# EAGLE board M8650D+cpld (EAGLE 6.6.0), part 1 of 2
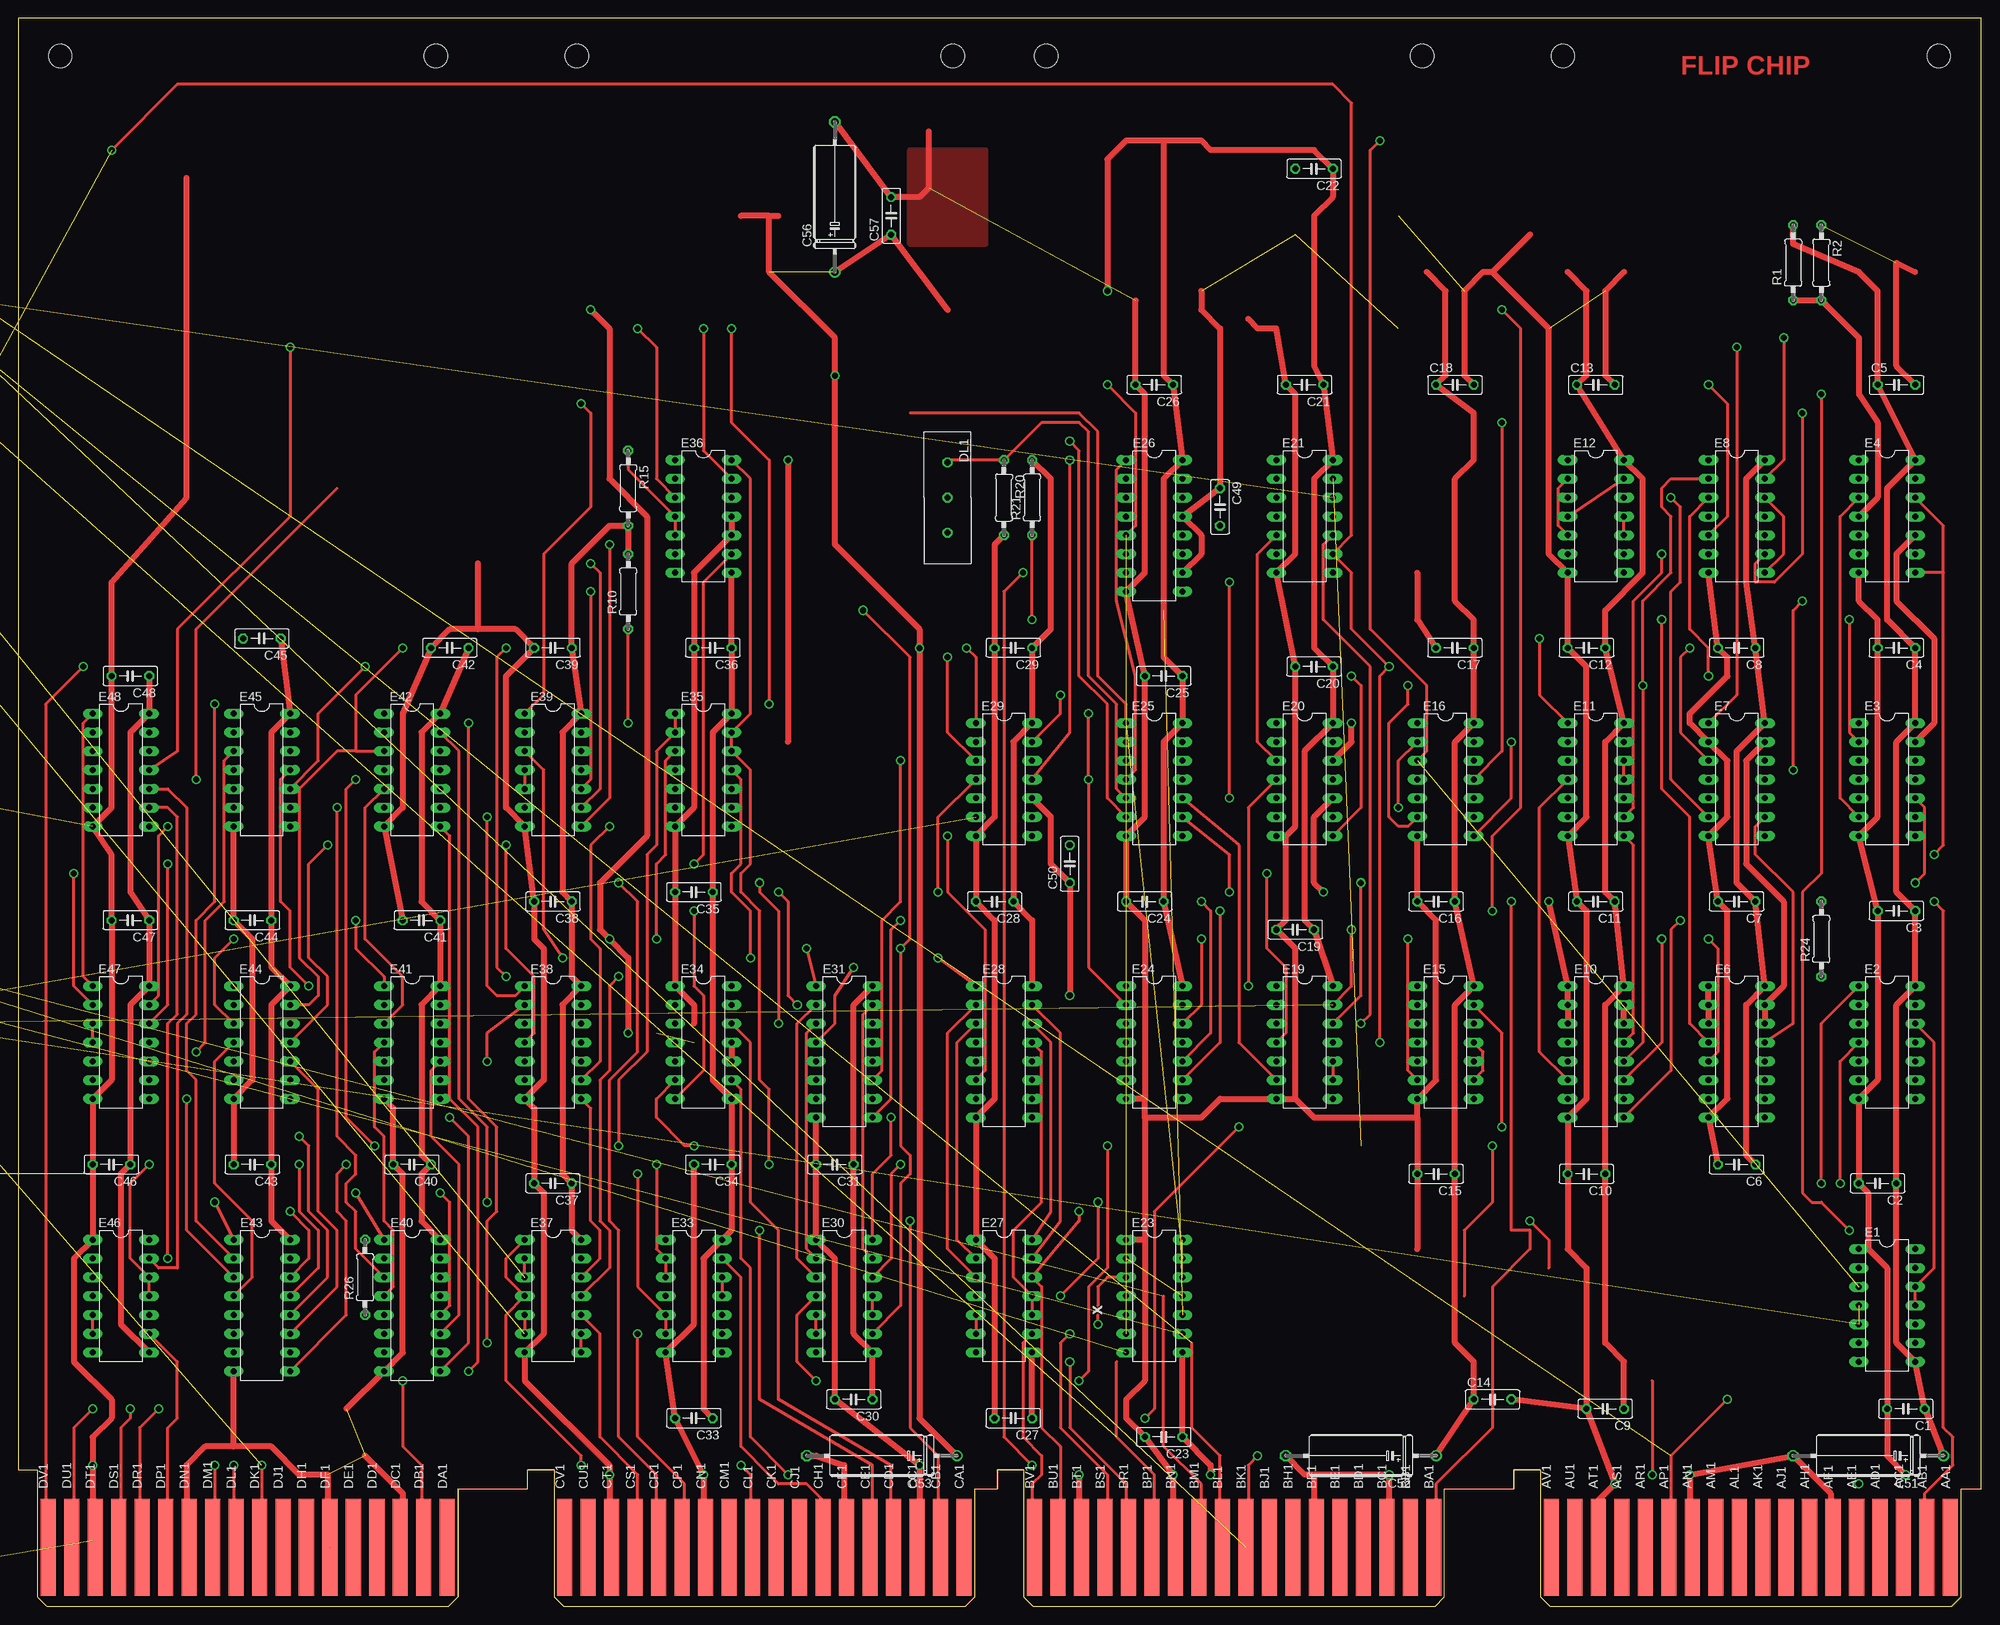
[diagram p3: board, top side]
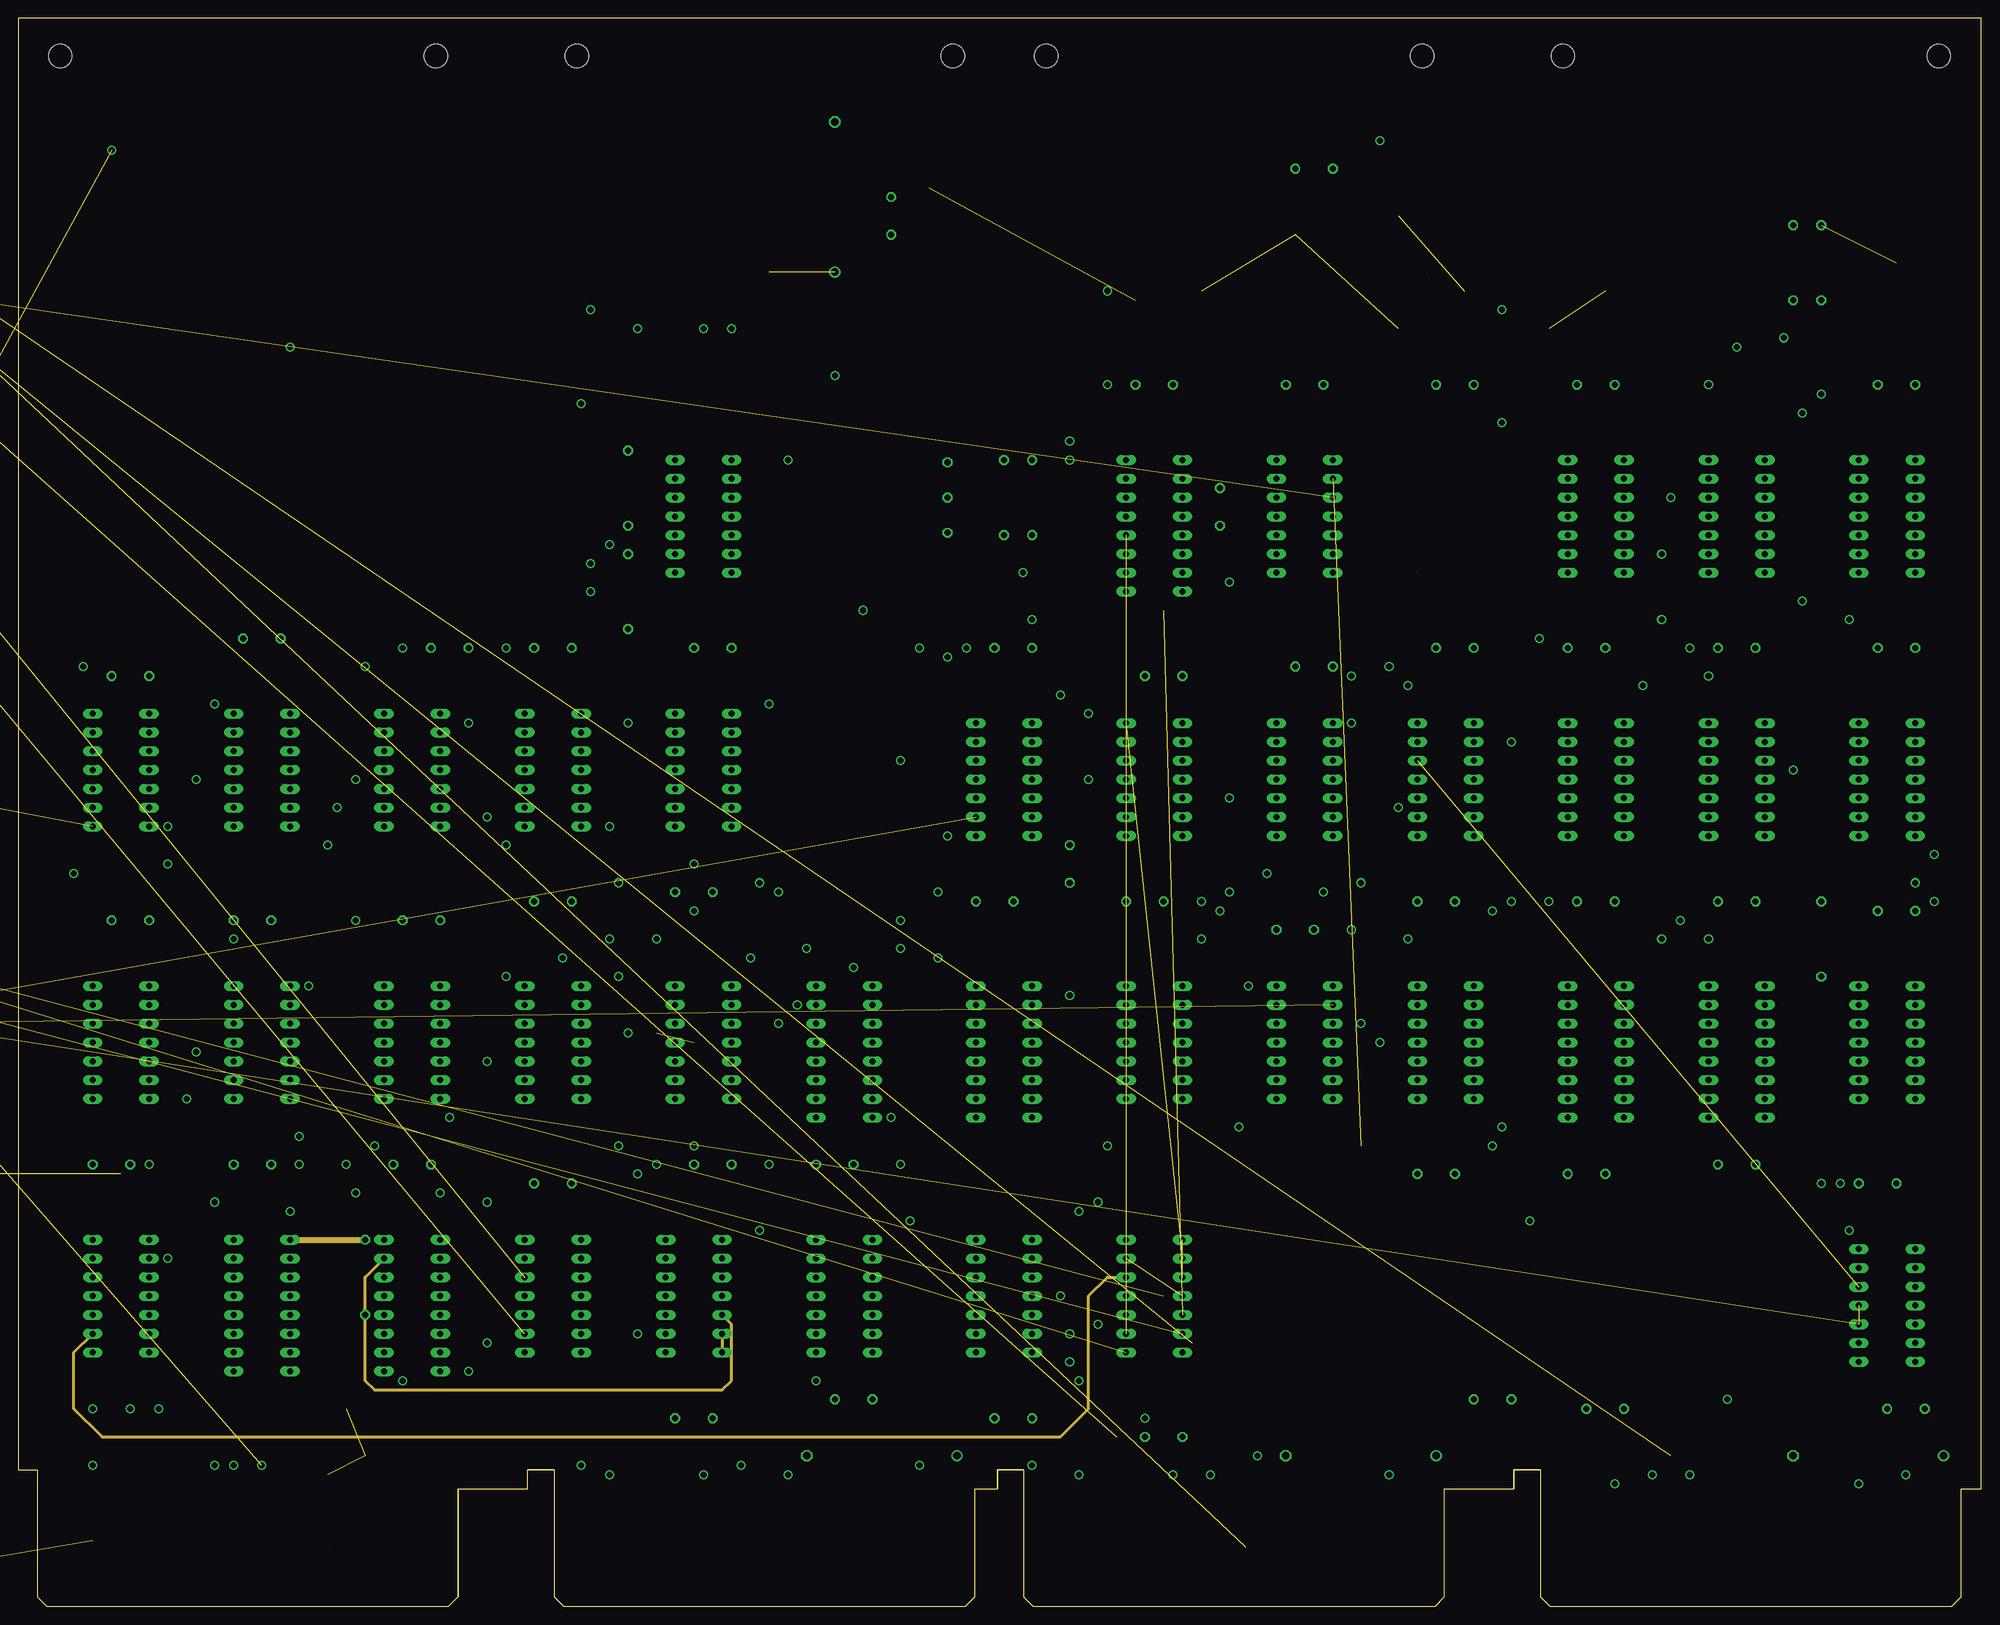
[diagram p4: board, inner layer ECO1]
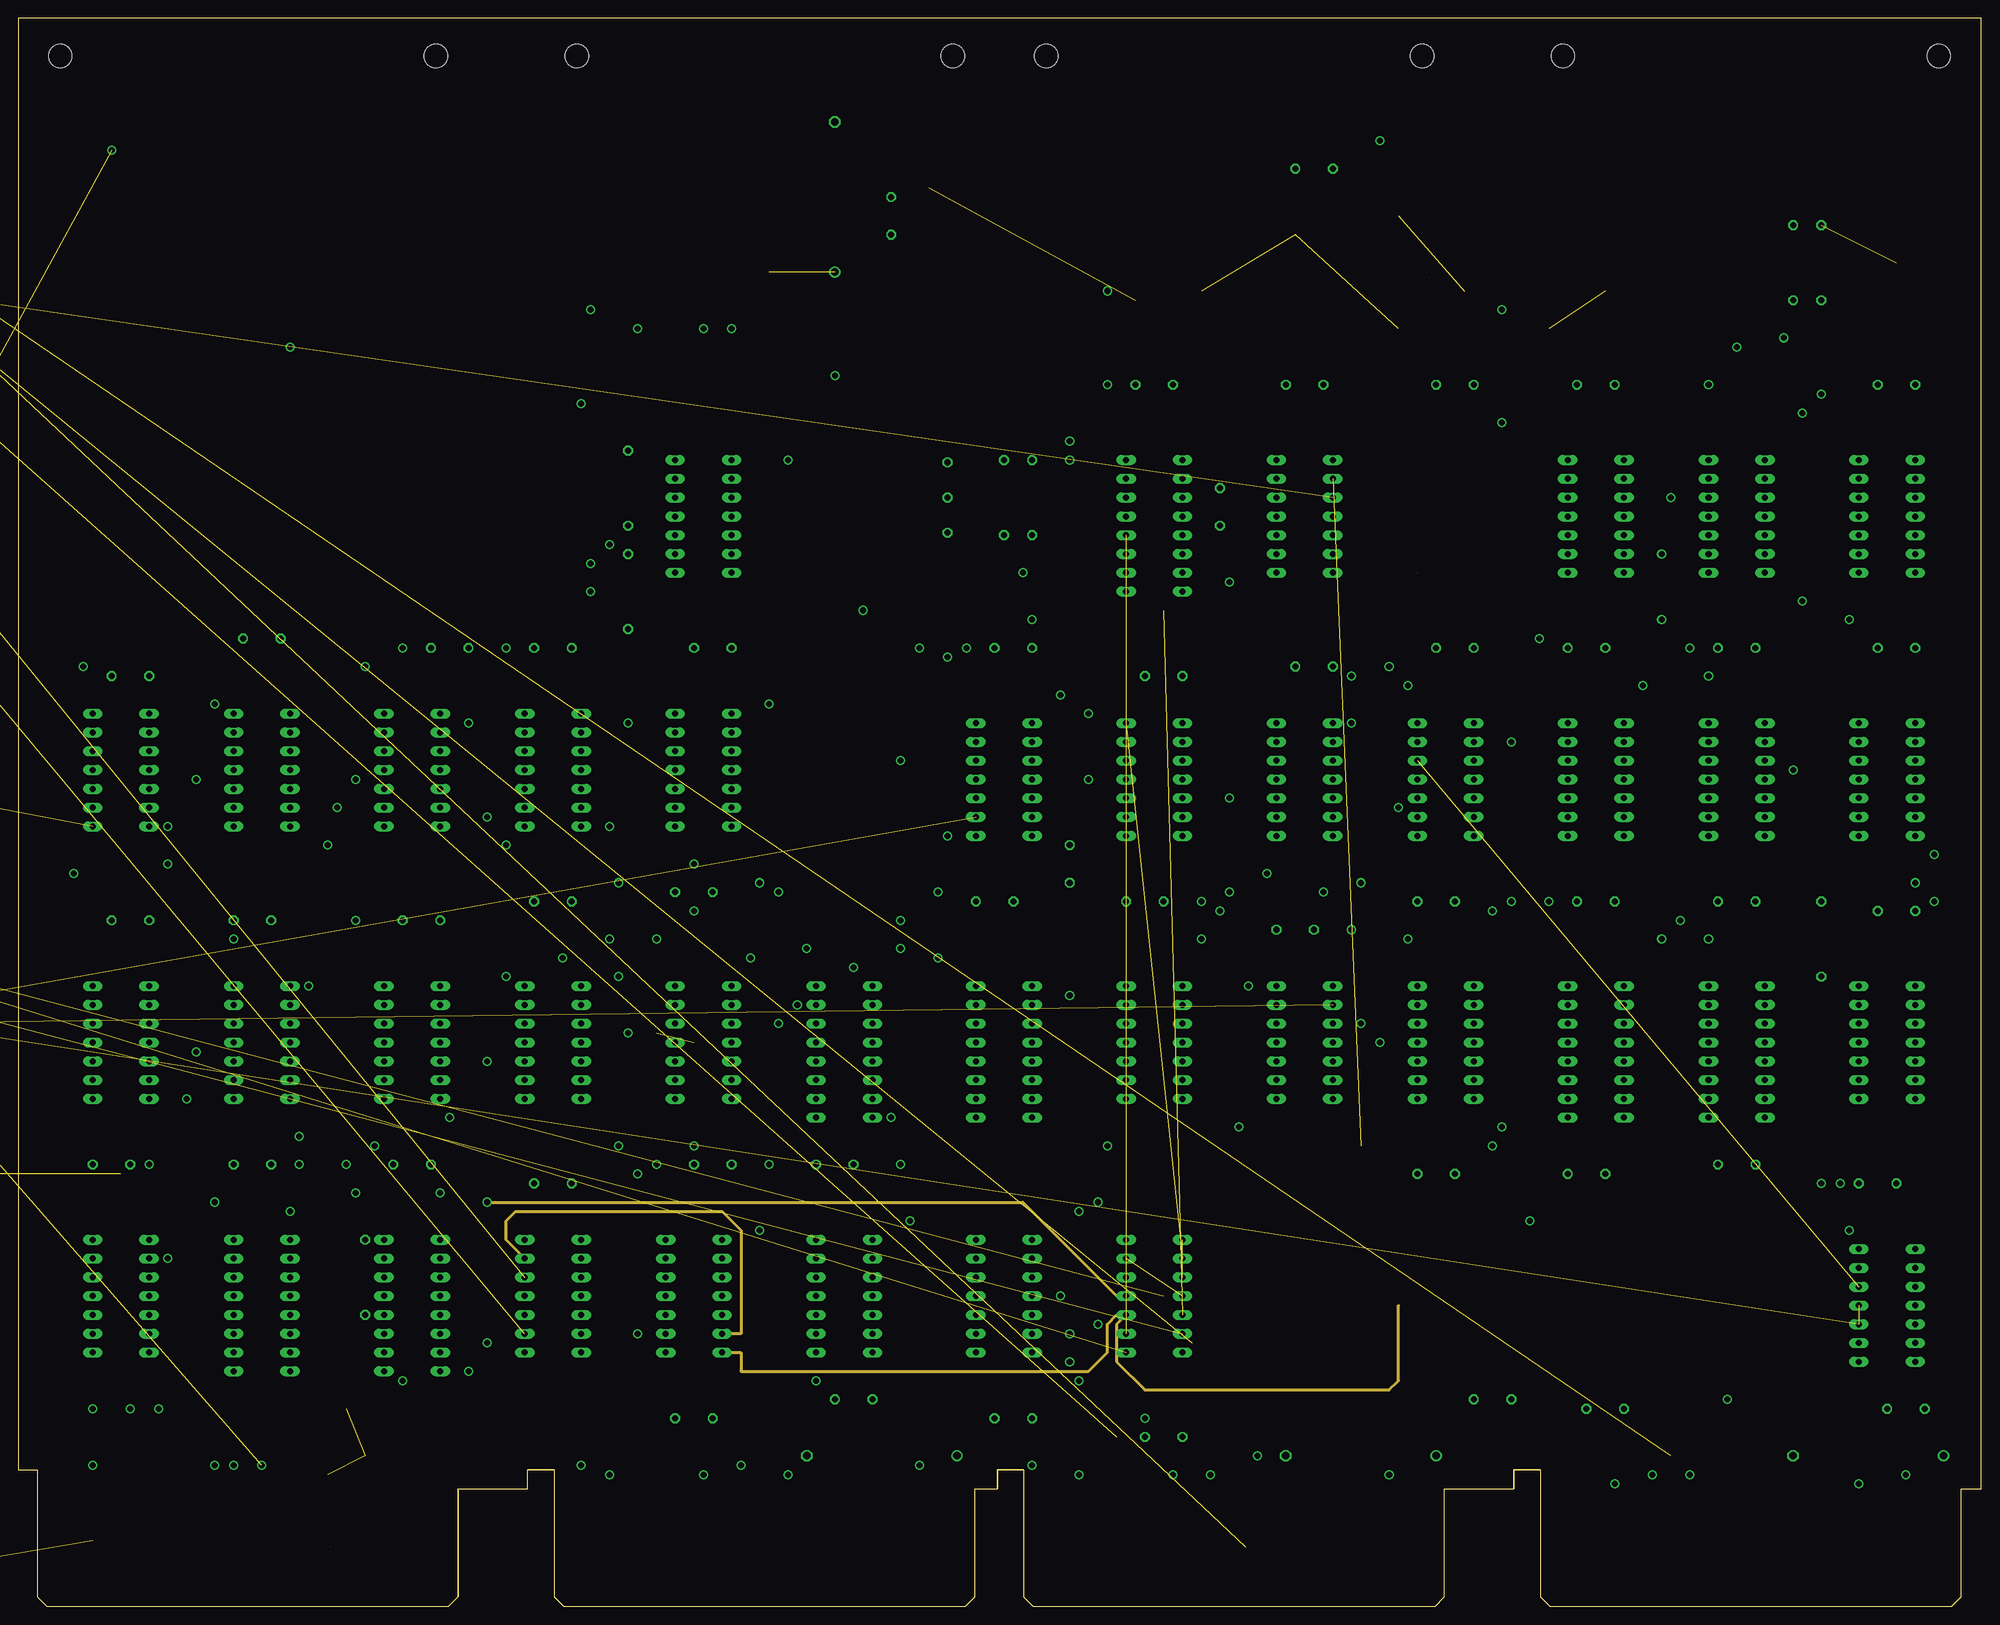
[diagram p5: board, inner layer ECO2]
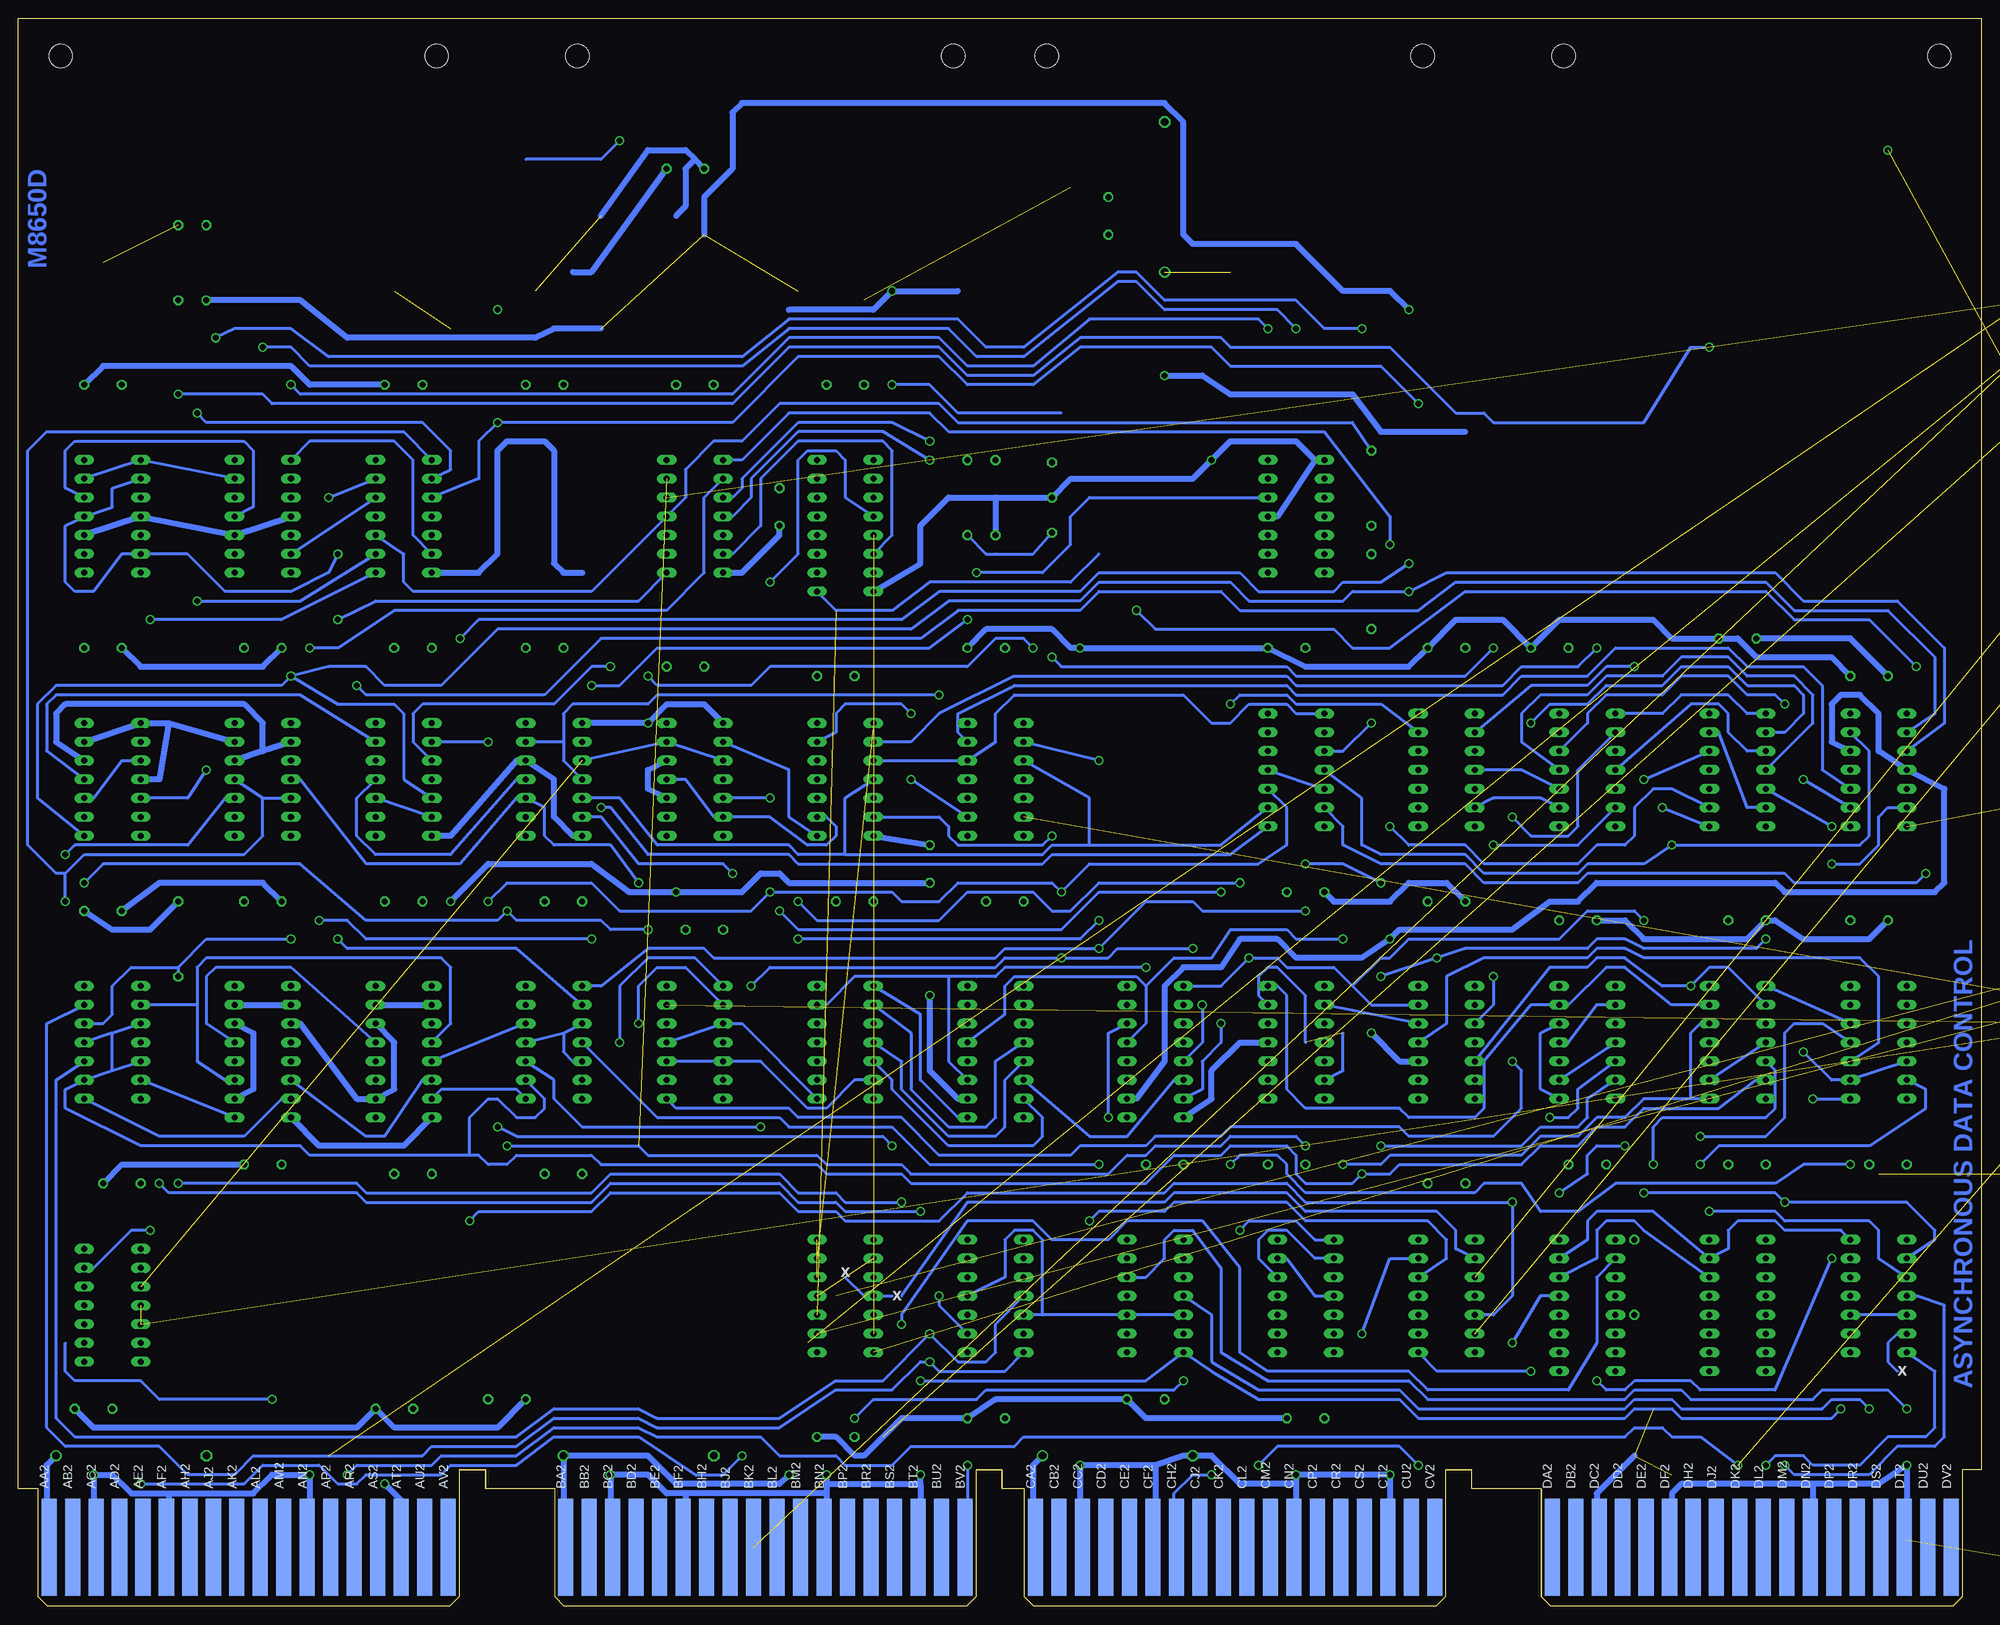
[diagram p6: board, bottom side, seen from below]

Size 265.3 x 214.63 mm. Coordinates in mm from the lower left corner, seen from the top.
Copper layers (1+2+15+16): Top 0.035mm / dielectric 1.5mm / ECO1 0.035mm / dielectric 0.15mm / ECO2 0.035mm / dielectric 0.2mm / Bottom 0.035mm
Design rules "16mils *": minimum track width 16mil, minimum drill 32mil, track to track 15mil, track to pad 10mil, pad to pad 10mil, via to via 10mil, smd to smd 10mil, copper to edge 13mil, drill to drill 10mil, minimum pad ring 10mil, minimum via ring 8mil, stop-mask expansion 0mil, vias tented up to drill 0mil, thermal gap 10mil
Net classes: 1 Supply: width 0.813 mm

## Footprints (pad centres in the part's own frame; a part is rotated, then mirrored left to right if it is on the bottom)
C050-025X075 = drill 0.813 octagon: 1 -2.54,0; 2 2.54,0
E12-8 = drill 1.016: + -10.16,0 | drill 1.016 octagon: - 10.16,0
RCL-L-00-05 = drill 0.813 octagon: 1 4.763,0; 2 0,0; 3 -4.763,0
DIL14 = drill 0.813 long: 1 -7.62,-3.81; 2 -5.08,-3.81; 3 -2.54,-3.81; 4 0,-3.81; 5 2.54,-3.81; 6 5.08,-3.81; 7 7.62,-3.81; 8 7.62,3.81; 9 5.08,3.81; 10 2.54,3.81; 11 0,3.81; 12 -2.54,3.81; 13 -5.08,3.81; 14 -7.62,3.81
DIL16 = drill 0.813 long: 1 -8.89,-3.81; 2 -6.35,-3.81; 3 -3.81,-3.81; 4 -1.27,-3.81; 5 1.27,-3.81; 6 3.81,-3.81; 7 6.35,-3.81; 8 8.89,-3.81; 9 8.89,3.81; 10 6.35,3.81; 11 3.81,3.81; 12 1.27,3.81; 13 -1.27,3.81; 14 -3.81,3.81; 15 -6.35,3.81; 16 -8.89,3.81
DIL08S = drill 0.813: 1 -3.81,-3.81; 4 3.81,-3.81; 5 3.81,3.81; 8 -3.81,3.81
DIL14S = drill 0.813: 1 -7.62,-3.81; 7 7.62,-3.81; 8 7.62,3.81; 14 -7.62,3.81
0207/10 = drill 0.813 octagon: 1 -5.08,0; 2 5.08,0
SIL10 = drill 0.813 long: 1 -11.43,0; 2 -8.89,0; 3 -6.35,0; 4 -3.81,0; 5 -1.27,0; 6 1.27,0; 7 3.81,0; 8 6.35,0; 9 8.89,0; 10 11.43,0
EDG-06 = drill 0.813 long: 1 -6.35,-3.81; 2 -3.81,-3.81; 3 -1.27,-3.81; 4 1.27,-3.81; 5 3.81,-3.81; 6 6.35,-3.81; 7 6.35,3.81; 8 3.81,3.81; 9 1.27,3.81; 10 -1.27,3.81; 11 -3.81,3.81; 12 -6.35,3.81
OMNIBUS = hole 3.175: 208.915,209.55; 259.715,209.55; 189.865,209.55; 139.065,209.55; 75.616,209.55; 126.416,209.55; 56.566,209.55; 5.766,209.55
EDGE-CON8 = smd 2.032 x 13.106: AA1 261.303,7.938; AB1 258.127,7.938; AC1 254.952,7.938; AD1 251.778,7.938; AE1 248.602,7.938; AF1 245.428,7.938; AH1 242.252,7.938; AJ1 239.077,7.938; AK1 235.903,7.938; AL1 232.727,7.938; AM1 229.553,7.938; AN1 226.377,7.938; AP1 223.202,7.938; AR1 220.028,7.938; AS1 216.852,7.938; AT1 213.678,7.938; AU1 210.502,7.938; AV1 207.327,7.938; BA1 191.452,7.938; BB1 188.278,7.938; BC1 185.102,7.938; BD1 181.928,7.938; BE1 178.752,7.938; BF1 175.577,7.938; BH1 172.403,7.938; BJ1 169.227,7.938; BK1 166.053,7.938; BL1 162.877,7.938; BM1 159.702,7.938; BN1 156.528,7.938; BP1 153.352,7.938; BR1 150.178,7.938; BS1 147.002,7.938; BT1 143.827,7.938; BU1 140.653,7.938; BV1 137.477,7.938; CA1 127.953,7.938; CB1 124.778,7.938; CC1 121.603,7.938; CD1 118.427,7.938; CE1 115.252,7.938; CF1 112.078,7.938; CH1 108.903,7.938; CJ1 105.728,7.938; CK1 102.552,7.938; CL1 99.377,7.938; CM1 96.203,7.938; CN1 93.028,7.938; CP1 89.853,7.938; CR1 86.677,7.938; CS1 83.502,7.938; CT1 80.328,7.938; CU1 77.153,7.938; CV1 73.978,7.938; DA1 58.102,7.938; DB1 54.928,7.938; DC1 51.752,7.938; DD1 48.578,7.938; DE1 45.403,7.938; DF1 42.227,7.938; DH1 39.053,7.938; DJ1 35.877,7.938; DK1 32.703,7.938; DL1 29.527,7.938; DM1 26.352,7.938; DN1 23.177,7.938; DP1 20.003,7.938; DR1 16.828,7.938; DS1 13.652,7.938; DT1 10.477,7.938; DU1 7.303,7.938; DV1 4.128,7.938 | smd 2.032 x 13.106 bottom: AA2 261.303,7.938; AB2 258.127,7.938; AC2 254.952,7.938; AD2 251.778,7.938; AE2 248.602,7.938; AF2 245.428,7.938; AH2 242.252,7.938; AJ2 239.077,7.938; AK2 235.903,7.938; AL2 232.727,7.938; AM2 229.553,7.938; AN2 226.377,7.938; AP2 223.202,7.938; AR2 220.028,7.938; AS2 216.852,7.938; AT2 213.678,7.938; AU2 210.502,7.938; AV2 207.327,7.938; BA2 191.452,7.938; BB2 188.278,7.938; BC2 185.102,7.938; BD2 181.928,7.938; BE2 178.752,7.938; BF2 175.577,7.938; BH2 172.403,7.938; BJ2 169.227,7.938; BK2 166.053,7.938; BL2 162.877,7.938; BM2 159.702,7.938; BN2 156.528,7.938; BP2 153.352,7.938; BR2 150.178,7.938; BS2 147.002,7.938; BT2 143.827,7.938; BU2 140.653,7.938; BV2 137.477,7.938; CA2 127.953,7.938; CB2 124.778,7.938; CC2 121.603,7.938; CD2 118.427,7.938; CE2 115.252,7.938; CF2 112.078,7.938; CH2 108.903,7.938; CJ2 105.728,7.938; CK2 102.552,7.938; CL2 99.377,7.938; CM2 96.203,7.938; CN2 93.028,7.938; CP2 89.853,7.938; CR2 86.677,7.938; CS2 83.502,7.938; CT2 80.328,7.938; CU2 77.153,7.938; CV2 73.978,7.938; DA2 58.102,7.938; DB2 54.928,7.938; DC2 51.752,7.938; DD2 48.578,7.938; DE2 45.403,7.938; DF2 42.227,7.938; DH2 39.053,7.938; DJ2 35.877,7.938; DK2 32.703,7.938; DL2 29.527,7.938; DM2 26.352,7.938; DN2 23.177,7.938; DP2 20.003,7.938; DR2 16.828,7.938; DS2 13.652,7.938; DT2 10.477,7.938; DU2 7.303,7.938; DV2 4.128,7.938
AMP_DB-9RA = drill 1.2: 1 -5.54,-1.42; 2 -2.77,-1.42; 3 0,-1.42; 4 2.77,-1.42; 5 5.54,-1.42; 6 -4.155,1.42; 7 -1.385,1.42; 8 1.385,1.42; 9 4.155,1.42 | drill 3.302 pad 4.5: G1 -12.5,0 | drill 3.18 pad 4.5: G2 12.5,0

## Placement (x,y rotation side)
C1  .01uF  [C050-025X075]  255.14,26.67 180 top
C2  .01uF  [C050-025X075]  251.33,57.15 180 top
C3  .01uF  [C050-025X075]  253.87,93.98 180 top
C4  .01uF  [C050-025X075]  253.87,129.54 180 top
C5  .01uF  [C050-025X075]  253.87,165.1 0 top
C6  .01uF  [C050-025X075]  232.28,59.69 180 top
C7  .01uF  [C050-025X075]  232.28,95.25 180 top
C8  .01uF  [C050-025X075]  232.28,129.54 180 top
C9  .01uF  [C050-025X075]  214.5,26.67 180 top
C10  .01uF  [C050-025X075]  211.96,58.42 180 top
C11  .01uF  [C050-025X075]  213.23,95.25 180 top
C12  .01uF  [C050-025X075]  211.96,129.54 180 top
C13  .01uF  [C050-025X075]  213.23,165.1 0 top
C14  .01uF  [C050-025X075]  199.26,27.94 0 top
C15  .01uF  [C050-025X075]  191.64,58.42 180 top
C16  .01uF  [C050-025X075]  191.64,95.25 180 top
C17  .01uF  [C050-025X075]  194.18,129.54 180 top
C18  .01uF  [C050-025X075]  194.18,165.1 0 top
C19  .01uF  [C050-025X075]  172.59,91.44 180 top
C20  .01uF  [C050-025X075]  175.13,127 180 top
C21  .01uF  [C050-025X075]  173.86,165.1 180 top
C22  .01uF  [C050-025X075]  175.13,194.31 180 top
C23  .01uF  [C050-025X075]  154.81,22.86 180 top
C24  .01uF  [C050-025X075]  152.27,95.25 180 top
C25  .01uF  [C050-025X075]  154.81,125.73 180 top
C26  .01uF  [C050-025X075]  153.54,165.1 180 top
C27  .01uF  [C050-025X075]  134.49,25.4 180 top
C28  .01uF  [C050-025X075]  131.95,95.25 180 top
C29  .01uF  [C050-025X075]  134.49,129.54 180 top
C30  .01uF  [C050-025X075]  112.9,27.94 180 top
C31  .01uF  [C050-025X075]  110.36,59.69 180 top
C33  .01uF  [C050-025X075]  91.31,25.4 180 top
C34  .01uF  [C050-025X075]  93.85,59.69 180 top
C35  .01uF  [C050-025X075]  91.31,96.52 180 top
C36  .01uF  [C050-025X075]  93.85,129.54 180 top
C37  .01uF  [C050-025X075]  72.26,57.15 180 top
C38  .01uF  [C050-025X075]  72.26,95.25 180 top
C39  .01uF  [C050-025X075]  72.26,129.54 180 top
C40  .01uF  [C050-025X075]  53.21,59.69 180 top
C41  .01uF  [C050-025X075]  54.48,92.71 180 top
C42  .01uF  [C050-025X075]  58.29,129.54 180 top
C43  .01uF  [C050-025X075]  31.62,59.69 180 top
C44  .01uF  [C050-025X075]  31.62,92.71 180 top
C45  .01uF  [C050-025X075]  32.89,130.81 180 top
C46  .01uF  [C050-025X075]  12.57,59.69 180 top
C47  .01uF  [C050-025X075]  15.11,92.71 180 top
C48  .01uF  [C050-025X075]  15.11,125.73 180 top
C49  .01uF  [C050-025X075]  162.43,148.59 270 top
C50  .01uF  [C050-025X075]  142.11,100.33 90 top
C51  6.8uF  [E12-8]  250.06,20.32 180 top
C52  6.8uF  [E12-8]  181.48,20.32 180 top
C53  6.8uF  [E12-8]  116.71,20.32 180 top
C56  6.8uF  [E12-8]  110.36,190.5 90 top
C57  .047uF  [C050-025X075]  117.98,187.96 90 top
DL1  30ns  [RCL-L-00-05]  125.6,149.86 270 top
E1  SP380N  [DIL14]  252.6,40.64 270 top
E2  97401  [DIL14]  252.6,76.2 270 top
E3  7474N  [DIL14]  252.6,111.76 270 top
E4  7474N  [DIL14]  252.6,147.32 270 top
E5  7493N  [DIL14]  -59.82,147.32 0 top  (outside the outline)
E6  DEC8271  [DIL16]  232.28,74.93 270 top
E7  7474N  [DIL14]  232.28,111.76 270 top
E8  7474N  [DIL14]  232.28,147.32 270 top
E9  7493N  [DIL14]  -20.45,72.39 0 top  (outside the outline)
E10  DEC8271  [DIL16]  213.23,74.93 270 top
E11  7402N  [DIL14]  213.23,111.76 270 top
E12  7400N  [DIL14]  213.23,147.32 270 top
E13  7493N  [DIL14]  -59.82,127 0 top  (outside the outline)
E14  7493N  [DIL14]  -20.45,62.23 0 top  (outside the outline)
E15  97401  [DIL14]  192.91,76.2 270 top
E16  7474N  [DIL14]  192.91,111.76 270 top
E17  7493N  [DIL14]  -59.82,-6.35 0 top  (outside the outline)
E18  7493N  [DIL14]  -59.82,-16.51 0 top  (outside the outline)
E19  7410N  [DIL14]  173.86,76.2 270 top
E20  7474N  [DIL14]  173.86,111.76 270 top
E21  7404N  [DIL14]  173.86,147.32 270 top
E23  SP380N  [DIL14]  153.54,41.91 270 top
E24  N8815  [DIL14]  153.54,76.2 270 top
E25  7450N  [DIL14]  153.54,111.76 270 top
E26  DEC8271  [DIL16]  153.54,146.05 270 top
E27  SP380N  [DIL14]  133.22,41.91 270 top
E28  DEC8271  [DIL16]  133.22,74.93 270 top
E29  7474N  [DIL14]  133.22,111.76 270 top
E30  SP380N  [DIL14]  111.63,41.91 270 top
E31  DEC8271  [DIL16]  111.63,74.93 270 top
E33  97401  [DIL14]  91.31,41.91 270 top
E34  SP384N  [DIL14]  92.58,76.2 270 top
E35  74H00N  [DIL14]  92.58,113.03 270 top
E36  SP384N  [DIL14]  92.58,147.32 270 top
E37  97401  [DIL14]  72.26,41.91 270 top
E38  74S74N  [DIL14]  72.26,76.2 270 top
E39  7450N  [DIL14]  72.26,113.03 270 top
E40  DEC8251  [DIL16]  53.21,40.64 270 top
E41  7400N  [DIL14]  53.21,76.2 270 top
E42  7404N  [DIL14]  53.21,113.03 270 top
E43  DEC8251  [DIL16]  32.89,40.64 270 top
E44  7400N  [DIL14]  32.89,76.2 270 top
E45  7402N  [DIL14]  32.89,113.03 270 top
E46  SP380N  [DIL14]  13.84,41.91 270 top
E47  7402N  [DIL14]  13.84,76.2 270 top
E48  7474N  [DIL14]  13.84,113.03 270 top
IC1  74S138N  [DIL16]  -19.18,191.77 0 top  (outside the outline)
IC2  74S138N  [DIL16]  -19.18,181.61 0 top  (outside the outline)
IC3  74151N  [DIL16]  -19.18,151.13 0 top  (outside the outline)
IC4  74151N  [DIL16]  -19.18,140.97 0 top  (outside the outline)
IC5  74S138N  [DIL16]  -19.18,113.03 0 top  (outside the outline)
IC6  74S138N  [DIL16]  -19.18,102.87 0 top  (outside the outline)
IC7  74S138N  [DIL16]  -19.18,92.71 0 top  (outside the outline)
IC8  74151N  [DIL16]  -19.18,82.55 0 top  (outside the outline)
IC9  74S11N  [DIL14]  -59.82,137.16 0 top  (outside the outline)
IC12  74LS27N  [DIL14]  -59.82,96.52 0 top  (outside the outline)
OSC  19.6608 MHz  [DIL08S]  -64.9,160.02 0 top  (outside the outline)
OSC1  19.6608 MHz  [DIL14S]  -61.09,160.02 0 top  (outside the outline)
R1  220  [0207/10]  239.9,181.61 90 top
R2  750  [0207/10]  243.71,181.61 270 top
R10  1K  [0207/10]  82.42,137.16 90 top
R15  1K  [0207/10]  82.42,151.13 270 top
R20  220  [0207/10]  133.22,149.86 270 top
R21  330  [0207/10]  137.03,149.86 90 top
R24  470  [0207/10]  243.71,90.17 90 top
R26  1K  [0207/10]  46.86,44.45 90 top
RN1  10K  [SIL10]  -17.91,119.38 0 top  (outside the outline)
SW1  CONF  [EDG-06]  -22.99,128.27 0 top  (outside the outline)
U$1  OUTLINE-OMNIBUS  [OMNIBUS]  -0.13,0 0 top
U$2  OMNIBUS  [EDGE-CON8]  -0.13,0 0 top
U$3  [FLIPCHIP]  205.61,212.09 270 top
USB  DB9  [AMP_DB-9RA]  -54.74,74.93 0 top  (outside the outline)